# Altium project knoobs.PrjPcb
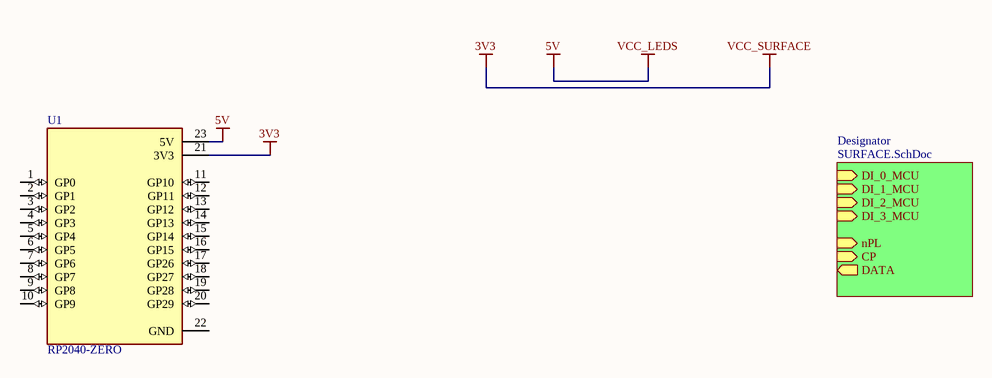
[diagram p0: KNOOBS_2040_ZERO.SchDoc]
5 sheets, 147 parts. Net scope: hierarchical (ports join the sheet entries above them; power ports are global).
Board file: KNOOBS_2040_ZERO.PcbDoc
Sheets:
  KNOOBS_2040_ZERO.SchDoc
    Designator = SURFACE.SchDoc
      BTN_FUNC = SR.SchDoc
      BANK_A = 16KNOBS.SchDoc
        K13 = KNOB.SchDoc
        K14 = KNOB.SchDoc
        K09 = KNOB.SchDoc
        K10 = KNOB.SchDoc
        K15 = KNOB.SchDoc
        K16 = KNOB.SchDoc
        K11 = KNOB.SchDoc
        K12 = KNOB.SchDoc
        BTN_TOP = SR.SchDoc
        SX_TOP = SR.SchDoc
        DX_TOP = SR.SchDoc
        K05 = KNOB.SchDoc
        K06 = KNOB.SchDoc
        K01 = KNOB.SchDoc
        K02 = KNOB.SchDoc
        K07 = KNOB.SchDoc
        K08 = KNOB.SchDoc
        K03 = KNOB.SchDoc
        K04 = KNOB.SchDoc
        BTN_BOT = SR.SchDoc
        SX_BOT = SR.SchDoc
        DX_BOT = SR.SchDoc

## Sheet KNOOBS_2040_ZERO.SchDoc
size A4; SheetNumber: 1; SheetTotal: 5

### Parts
U1  RP2040-ZERO  [MODULE_RP2040-ZERO]

### Sub-sheets
Designator = SURFACE.SchDoc: DI_0_MCU (in), DI_1_MCU (in), DI_2_MCU (in), DI_3_MCU (in), nPL (in), CP (in), DATA (out)

### Nets
3V3: U1.21(3V3)  [also labelled VCC_SURFACE]
5V: U1.23(5V)  [also labelled VCC_LEDS]

Not connected (* = marked no-connect by the designer): U1 1(GP0) 2(GP1) 3(GP2) 4(GP3) 5(GP4) 6(GP5) 7(GP6) 8(GP7) 9(GP8) 10(GP9) 11(GP10) 12(GP11) 13(GP12) 14(GP13) 15(GP14) 16(GP15) 17(GP26) 18(GP27) 19(GP28) 20(GP29) 22(GND)

### Library data of the parts
U1 = RP2040-ZERO: Low-Cost, High-Performance Pico-Like MCU Board Based On Raspberry Pi Microcontroller RP2040; MF: Waveshare Electronics; SnapEDA_Link: https://www.snapeda.com/parts/RP2040-ZERO/Waveshare+Electronics/view-part/?ref=snap; Package: Package; Value: *; MP: RP2040-ZERO; Check_prices: https://www.snapeda.com/parts/RP2040-ZERO/Waveshare+Electronics/view-part/?ref=eda

## Sheet SURFACE.SchDoc
size A4; SheetNumber: 2; SheetTotal: 5
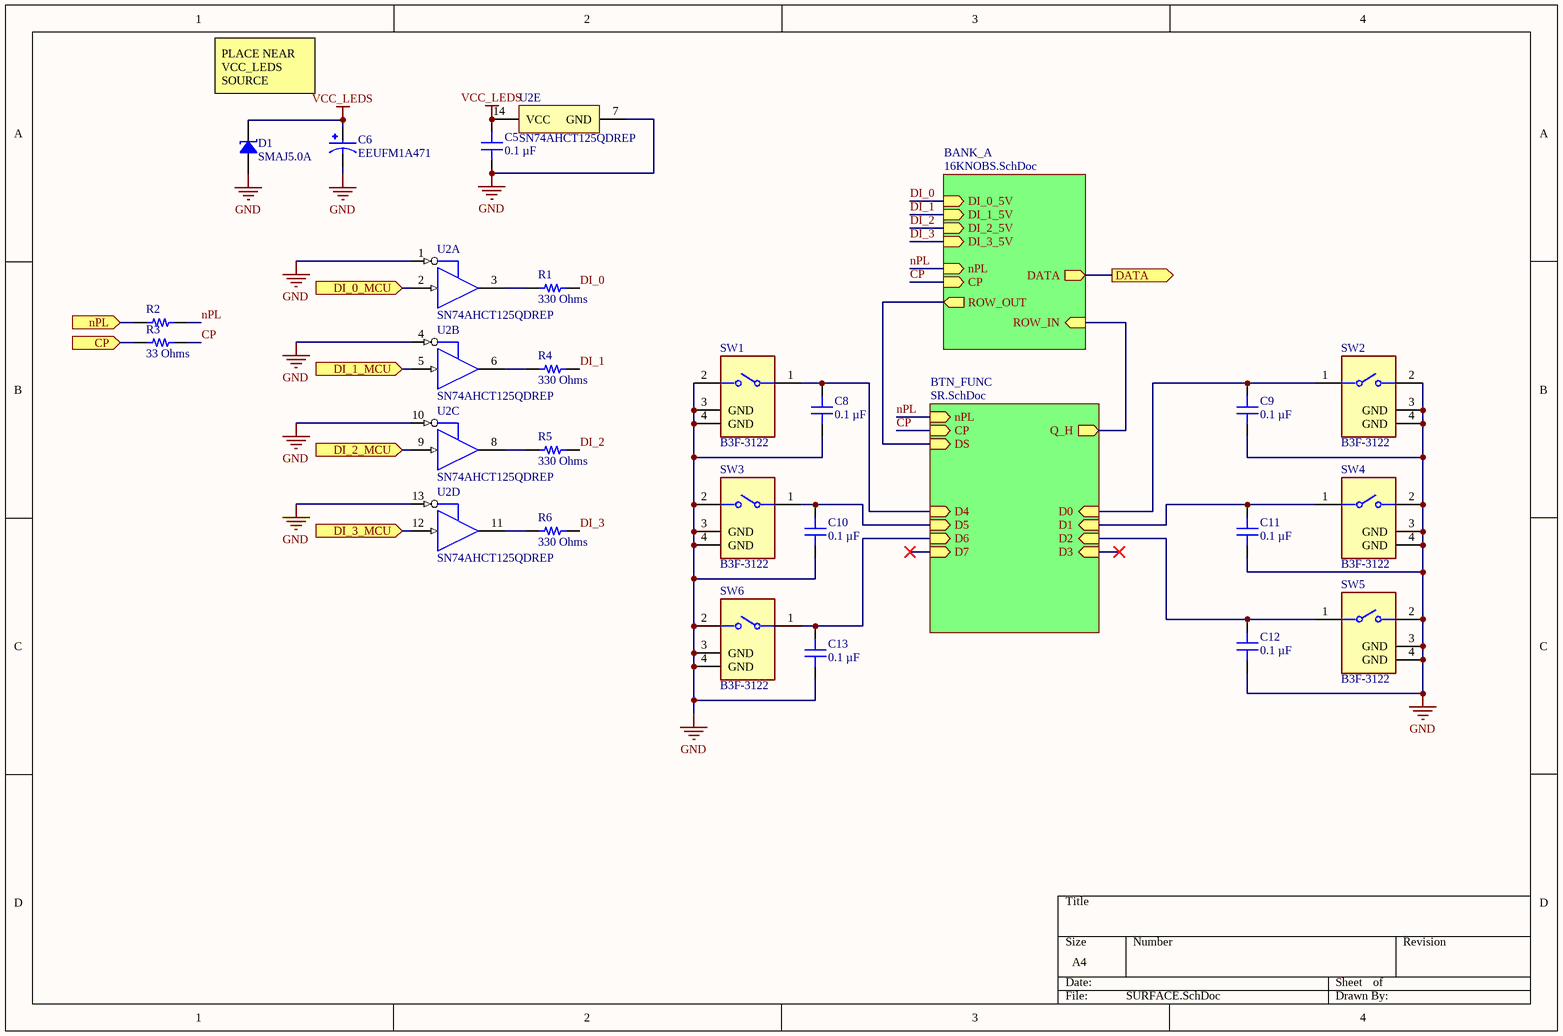
[diagram p1: SURFACE.SchDoc]

### Parts
C5  0.1 µF  [CAP 0603_1608]
C6  EEUFM1A471  [CAPPRD350W60D800H1150]
C8  0.1 µF  [CAP 0603_1608]
C9  0.1 µF  [CAP 0603_1608]
C10  0.1 µF  [CAP 0603_1608]
C11  0.1 µF  [CAP 0603_1608]
C12  0.1 µF  [CAP 0603_1608]
C13  0.1 µF  [CAP 0603_1608]
D1  SMAJ5.0A  [DO214AC SMA]
R1  330 Ohms  [YAGEO RES 0603_1608]
R2  33 Ohms  [YAGEO RES 0603_1608]  (value not drawn)
R3  33 Ohms  [YAGEO RES 0603_1608]
R4  330 Ohms  [YAGEO RES 0603_1608]
R5  330 Ohms  [YAGEO RES 0603_1608]
R6  330 Ohms  [YAGEO RES 0603_1608]
SW1  B3F-3122  [FP-B3F-3122-MFG]
SW2  B3F-3122  [FP-B3F-3122-MFG]
SW3  B3F-3122  [FP-B3F-3122-MFG]
SW4  B3F-3122  [FP-B3F-3122-MFG]
SW5  B3F-3122  [FP-B3F-3122-MFG]
SW6  B3F-3122  [FP-B3F-3122-MFG]
U2  SN74AHCT125QDREP  [D0014A_L]  (parts A,B,C,D,E of 5)

### Sub-sheets
BANK_A = 16KNOBS.SchDoc: DI_0_5V (in), DI_1_5V (in), nPL (in), CP (in), DI_2_5V (in), DI_3_5V (in), DATA (out), ROW_IN (in), ROW_OUT (out)
BTN_FUNC = SR.SchDoc: nPL (in), CP (in), DS (in), Q_H (out), D4 (in), D5 (in), D6 (in), D7 (in), D0 (in), D1 (in), D2 (in), D3 (in)

### Ports
CP (in), DATA (out), DI_0_MCU (in), DI_1_MCU (in), DI_2_MCU (in), DI_3_MCU (in), nPL (in)

### Nets
GND: C5.1 C6.N C8.1 C9.1 C10.1 C11.1 C12.1 C13.1 D1.1 SW1.2 SW1.3(GND) SW1.4(GND) SW2.2 SW2.3(GND) SW2.4(GND) SW3.2 SW3.3(GND) SW3.4(GND) SW4.2 SW4.3(GND) SW4.4(GND) SW5.2 SW5.3(GND) SW5.4(GND) SW6.2 SW6.3(GND) SW6.4(GND) U2.1(1~{OE}) U2.4(2~{OE}) U2.7(GND) U2.10(3~{OE}) U2.13(4~{OE})
VCC_LEDS: C5.2 C6.P D1.2 U2.14(VCC)  [project net 5V]
CP: R3.2 ; sheet BTN_FUNC/CP, sheet BANK_A/CP
DI_0: R1.2 ; sheet BANK_A/DI_0_5V
DI_1: R4.2 ; sheet BANK_A/DI_1_5V
DI_2: R5.2 ; sheet BANK_A/DI_2_5V
DI_3: R6.2 ; sheet BANK_A/DI_3_5V
nPL: R2.2 ; sheet BTN_FUNC/nPL, sheet BANK_A/nPL
NetC8_2: C8.2 SW1.1 ; sheet BTN_FUNC/D4
NetC9_2: C9.2 SW2.1 ; sheet BTN_FUNC/D0
NetC10_2: C10.2 SW3.1 ; sheet BTN_FUNC/D5
NetC11_2: C11.2 SW4.1 ; sheet BTN_FUNC/D1
NetC12_2: C12.2 SW5.1 ; sheet BTN_FUNC/D2
NetC13_2: C13.2 SW6.1 ; sheet BTN_FUNC/D6
NetR1_1: R1.1 U2.3(1Y)
NetR2_1: R2.1 ; port nPL
NetR3_1: R3.1 ; port CP
NetR4_1: R4.1 U2.6(2Y)
NetR5_1: R5.1 U2.8(3Y)
NetR6_1: R6.1 U2.11(4Y)
NetSR_BTN_FUNC_9: sheet BTN_FUNC/Q_H, sheet BANK_A/ROW_IN
NetSR_BTN_FUNC_10: sheet BTN_FUNC/DS, sheet BANK_A/ROW_OUT
NetSR_DX_TOP_9: port DATA, sheet BANK_A/DATA
NetU2_2: U2.2(1A) ; port DI_0_MCU
NetU2_5: U2.5(2A) ; port DI_1_MCU
NetU2_9: U2.9(3A) ; port DI_2_MCU
NetU2_12: U2.12(4A) ; port DI_3_MCU

### Notes on the sheet
- PLACE NEAR
  VCC_LEDS SOURCE

### Library data of the parts
C5 C8-C13 = CC0603KPX7R7BB104: CAP CER 0.1UF 16V X7R 0603; manufacturer: Yageo; Tolerance: ±10%; Part Number: CC0603KPX7R7BB104; Value: 0.1 µF; Applications: General Purpose; Capacitance: 0.1 µF; componentlink1description: Datasheet; componentlink1url: https://www.yageo.com/upload/media/product/productsearch/datasheet/mlcc/UPY-GPHC_X7R_6.3V-to-50V_18.pdf; componentlink2description: DigiKey Link; componentlink2url: https://www.digikey.com/en/products/detail/yageo/CC0603KPX7R7BB104/2103073; Device Package: 0603 (1608 Metric); lastupdated: 2/9/2024 8:10:09 PM; Lifecycle Status: Active; Minimum Order: 1; Mounting Type: Surface Mount, MLCC; Operating Temperature: -55°C ~ 125°C; Package / Case: 0603 (1608 Metric); packaging: TapeAndReel; partid: 16718; Part Status: Active; price: 0.01; series: CC; Size / Dimension: 0.063" L x 0.031" W (1.60mm x 0.80mm); Supplier 1: DigiKey; Supplier Part Number 1: 311-1335-1-ND; Temperature Coefficient: X7R; Thickness (Max): 0.035" (0.90mm); Voltage - Rated: 16V
C6 = EEUFM1A471: Cap Aluminum Lytic 470uF 10V 20% (8 X 11.5mm) Radial 3.5mm 950mA 3000h 105C Bulk; MP: EEU-FM1A471; MF: Panasonic; Purchase-URL: https://pricing.snapeda.com/search/part/EEU-FM1A471/?ref=eda; SnapEDA_Link: https://www.snapeda.com/parts/EEU-FM1A471/Panasonic/view-part/2301689/?ref=snap; Check_prices: https://www.snapeda.com/parts/EEU-FM1A471/Panasonic/view-part/2301689/?ref=eda; Availability: In Stock; Package: RADIAL-2 Panasonic; Value: *; Price: None
D1 = SMAJ5.0A: TVS DIODE 5VWM 9.2VC DO214AC; Manufacturer: Littelfuse Inc.; Current - Peak Pulse (10/1000µs): 43.5A; Power Line Protection: No; Power - Peak Pulse: 400W; Type: Zener; Unidirectional Channels: 1; Voltage - Breakdown (Min): 6.4V; Voltage - Clamping (Max) @ Ipp: 9.2V; Voltage - Reverse Standoff (Typ): 5V; Part Number: SMAJ5.0A; Applications: General Purpose; ComponentLink1Description: Datasheet; ComponentLink1URL: https://www.littelfuse.com/~/media/electronics/datasheets/tvs_diodes/littelfuse_tvs_diode_smaj_datasheet.pdf.pdf; ComponentLink2Description: DigiKey Link; ComponentLink2URL: https://www.digikey.com/en/products/detail/littelfuse-inc/SMAJ5-0A/762250; LastUpdated: 6/3/2024 7:57:22 PM; Lifecycle Status: Active; Minimum Order: 1; Mounting Type: Surface Mount; Operating Temperature: -65°C ~ 150°C (TJ); Package / Case: DO-214AC, SMA; Packaging: TapeAndReel; PartId: 5719; Part Status: Active; Price: 0.09; Series: SMAJ; Supplier 1: DigiKey; Supplier Part Number 1: SMAJ5.0ALFCT-ND; Supplier Device Package: DO-214AC (SMA)
R1 R4-R6 = RC0603JR-07330RP: RES 330 OHM 5% 1/10W 0603; Manufacturer: Yageo; Power (Watts): 0.1W, 1/10W; Ratings: 7C1 RoHS w/out Exemption (100% Pb-Free); Temperature Coefficient: ±100ppm/°C; Part Number: RC0603JR-07330RP; Value: 330 Ohms; ComponentLink1Description: Datasheet; ComponentLink1URL: http://www.yageo.com/NewPortal/yageodocoutput?fileName=/pdf/R-Chip/PYu-RC_51_RoHS_P_0.pdf; ComponentLink2Description: DigiKey Link; ComponentLink2URL: https://www.digikey.com/en/products/detail/yageo/RC0603JR-07330RP/4935329; Composition: Thick Film; Device Package: 0603 (1608 Metric); Features: Moisture Resistant; Height - Seated (Max): 0.022" (0.55mm); LastUpdated: 7/25/2024 9:19:30 AM; Lifecycle Status: Active; Minimum Order: 1; Number of Terminations: 2; Operating Temperature: -55°C ~ 155°C; Package / Case: 0603 (1608 Metric); Packaging: TapeAndReel; PartId: 9775; Part Status: Active; Price: 0.01; Resistance: 330 Ohms; Series: RC_P; Size / Dimension: 0.063" L x 0.031" W (1.60mm x 0.80mm); Supplier 1: DigiKey; Supplier Part Number 1: YAG1314CT-ND; Supplier Device Package: 0603; Tolerance: ±5%
R2 R3 = RC0603JR-0733RL: RES 33 OHM 5% 1/10W 0603; Manufacturer: Yageo; Power (Watts): 0.1W, 1/10W; Temperature Coefficient: ±100ppm/°C; Part Number: RC0603JR-0733RL; Value: 33 Ohms; ComponentLink1Description: Datasheet; ComponentLink1URL: https://www.yageo.com/upload/media/product/productsearch/datasheet/rchip/PYu-RC_Group_51_RoHS_L_10.pdf; ComponentLink2Description: DigiKey Link; ComponentLink2URL: https://www.digikey.com/en/products/detail/yageo/RC0603JR-0733RL/726771; Composition: Thick Film; Device Package: 0603 (1608 Metric); Features: Moisture Resistant; Height - Seated (Max): 0.022" (0.55mm); LastUpdated: 7/25/2024 9:19:24 AM; Lifecycle Status: Active; Minimum Order: 1; Number of Terminations: 2; Operating Temperature: -55°C ~ 155°C; Package / Case: 0603 (1608 Metric); Packaging: CutTape; PartId: 17082; Part Status: Active; Price: 0.01; Resistance: 33 Ohms; Series: RC_L; Size / Dimension: 0.063" L x 0.031" W (1.60mm x 0.80mm); Supplier 1: DigiKey; Supplier Part Number 1: 311-33GRCT-ND; Supplier Device Package: 0603; Tolerance: ±5%
SW1-SW6 = CMP-08834-000053-1: SWITCH TACTILE SPST-NO 0.05A 24V; Max Current Rating: 50mA; Actuator Type: Standard; Ratings: IP00; Number of Poles: 1; Mechanical Life: 300000Cycles; Illumination Type: Non-Illuminated; Switch Function: Off-Mom; Actuator Color: Grey; Contact Resistance: 100mR; Throw Configuration: SPST; Actuator Length: 1.6mm; Switch Travel: 0.25mm; Operating Force: 1.47N; Weight: 0.25g; Voltage Rating (DC): 24V; Contact Plating: Gold; RoHS Compliant: Yes; Contact Material: Gold; Radiation Hardening: No; Packaging: Bulk; Height: 7.4mm; Min Operating Temperature: -25°C; Electrical Life: 300000Cycles; Depth: 7.85mm; Max Voltage Rating (DC): 24V; Mount: Through Hole; Width: 6.25mm; Current Rating: 50mA; Lead Free: Lead Free; Max Operating Temperature: 70°C; Series: B3F; Contact Current Rating: 50mA; Package Quantity: 1000; Termination: PC Pins; Orientation: Right Angle; Length: 7.3mm
U2 = CMP-0440-00320-3: Enhanced Product Quadruple Bus Buffer Gates With 3-State Outputs, D0014A, LARGE T&R; Manufacturer: Texas Instruments; Generic Part Number: SN74AHCT125-EP; Output Type: CMOS; VCC(Min)(V): 4.5; Input Type: TTL; Rating: HiRel Enhanced Product; ICC @ Nom Voltage(Max)(mA): 0.02; tpd @ Nom Voltage(Max)(ns): 8.5; VCC(Max)(V): 5.5; Voltage(Nom)(V): 5; F @ Nom Voltage(Max)(Mhz): 110; Operating Temperature Range(C): -40 to 125; PackageReference: D0014A; DatasheetVersion: SCLS549; Code_JEDEC: MS-012; PackageVersion: http://www.ti.com/lit/ml/mpds177g/mpds177g.pdf

## Sheet SR.SchDoc
size A4; SheetNumber: 5; SheetTotal: 5
Used 7 times, as channels Designator/BTN_FUNC, Designator/BANK_A/BTN_TOP, Designator/BANK_A/SX_TOP, Designator/BANK_A/DX_TOP, Designator/BANK_A/BTN_BOT, Designator/BANK_A/SX_BOT, Designator/BANK_A/DX_BOT. Parts and nets are listed once, with the designators drawn on the sheet.
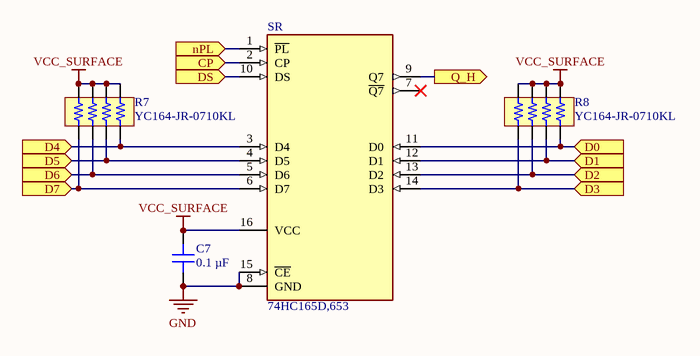
[diagram p2: SR.SchDoc]

### Parts
C7  0.1 µF  [CAP 0603_1608]
R7  YC164-JR-0710KL  [RESNET 1206-8 CONVEX]
R8  YC164-JR-0710KL  [RESNET 1206-8 CONVEX]
SR  74HC165D,653  [FP-SOT109-1-MFG]

### Ports
CP (in), D0 (in), D1 (in), D2 (in), D3 (in), D4 (in), D5 (in), D6 (in), D7 (in), DS (in), nPL (in), Q_H (out)

### Nets
GND: C7.1 SR.8(GND) SR.15(~{CE})
VCC_SURFACE: C7.2 R7.5 R7.6 R7.7 R7.8 R8.5 R8.6 R8.7 R8.8 SR.16(VCC)
CP: SR.2(CP) ; port CP
D0: R8.4 SR.11(D0) ; port D0
D1: R8.3 SR.12(D1) ; port D1
D2: R8.2 SR.13(D2) ; port D2
D3: R8.1 SR.14(D3) ; port D3
D4: R7.4 SR.3(D4) ; port D4
D5: R7.3 SR.4(D5) ; port D5
D6: R7.2 SR.5(D6) ; port D6
D7: R7.1 SR.6(D7) ; port D7
DS: SR.10(DS) ; port DS
nPL: SR.1(~{PL}) ; port nPL
Q_H: SR.9(Q7) ; port Q_H

Not connected (* = marked no-connect by the designer): SR 7(~{Q7})*

### Channels
Designator/BTN_FUNC: designators end in _BTN_FUNC; ports CP=CP D0=NetC9_2 D1=NetC11_2 D2=NetC12_2 D3=NetR8_BTN_FUNC_1 D4=NetC8_2 D5=NetC10_2 D6=NetC13_2 D7=NetR7_BTN_FUNC_1 DS=NetSR_BTN_FUNC_10 nPL=nPL Q_H=NetSR_BTN_FUNC_9
Designator/BANK_A/BTN_TOP: designators end in _BTN_TOP; ports CP=CP D0=NetC2_K09_2 D1=NetC2_K10_2 D2=NetC2_K11_2 D3=NetC2_K12_2 D4=NetC2_K16_2 D5=NetC2_K15_2 D6=NetC2_K14_2 D7=NetC2_K13_2 DS=NetSR_BTN_TOP_10 nPL=nPL Q_H=NetSR_BTN_TOP_9
Designator/BANK_A/SX_TOP: designators end in _SX_TOP; ports CP=CP D0=NetC3_K09_2 D1=NetC1_K09_2 D2=NetC3_K10_2 D3=NetC1_K10_2 D4=NetC3_K14_2 D5=NetC1_K14_2 D6=NetC3_K13_2 D7=NetC1_K13_2 DS=NetSR_BTN_FUNC_9 nPL=nPL Q_H=NetSR_BTN_TOP_10
Designator/BANK_A/DX_TOP: designators end in _DX_TOP; ports CP=CP D0=NetC3_K11_2 D1=NetC1_K11_2 D2=NetC3_K12_2 D3=NetC1_K12_2 D4=NetC3_K16_2 D5=NetC1_K16_2 D6=NetC3_K15_2 D7=NetC1_K15_2 DS=NetSR_BTN_TOP_9 nPL=nPL Q_H=NetSR_DX_TOP_9
Designator/BANK_A/BTN_BOT: designators end in _BTN_BOT; ports CP=CP D0=NetC2_K08_2 D1=NetC2_K07_2 D2=NetC2_K06_2 D3=NetC2_K05_2 D4=NetC2_K01_2 D5=NetC2_K02_2 D6=NetC2_K03_2 D7=NetC2_K04_2 DS=NetSR_BTN_BOT_10 nPL=nPL Q_H=NetSR_BTN_BOT_9
Designator/BANK_A/SX_BOT: designators end in _SX_BOT; ports CP=CP D0=NetC3_K06_2 D1=NetC1_K06_2 D2=NetC3_K05_2 D3=NetC1_K05_2 D4=NetC3_K01_2 D5=NetC1_K01_2 D6=NetC3_K02_2 D7=NetC1_K02_2 DS=NetSR_BTN_BOT_9 nPL=nPL Q_H=NetSR_BTN_FUNC_10
Designator/BANK_A/DX_BOT: designators end in _DX_BOT; ports CP=CP D0=NetC3_K08_2 D1=NetC1_K08_2 D2=NetC3_K07_2 D3=NetC1_K07_2 D4=NetC3_K03_2 D5=NetC1_K03_2 D6=NetC3_K04_2 D7=NetC1_K04_2 DS=GND nPL=nPL Q_H=NetSR_BTN_BOT_10

### Library data of the parts
C7 = CC0603KPX7R7BB104: as C5 on sheet SURFACE; Part Number: CC0603KPX7R7BB104; Value: 0.1 µF; Applications: General Purpose; Capacitance: 0.1 µF; componentlink1description: Datasheet; componentlink1url: https://www.yageo.com/upload/media/product/productsearch/datasheet/mlcc/UPY-GPHC_X7R_6.3V-to-50V_18.pdf; componentlink2description: DigiKey Link; componentlink2url: https://www.digikey.com/en/products/detail/yageo/CC0603KPX7R7BB104/2103073; Device Package: 0603 (1608 Metric); lastupdated: 2/9/2024 8:10:09 PM; Lifecycle Status: Active; Minimum Order: 1; Mounting Type: Surface Mount, MLCC; Operating Temperature: -55°C ~ 125°C; Package / Case: 0603 (1608 Metric); packaging: TapeAndReel; partid: 16718; Part Status: Active; price: 0.01; series: CC; Size / Dimension: 0.063" L x 0.031" W (1.60mm x 0.80mm); Supplier 1: DigiKey; Supplier Part Number 1: 311-1335-1-ND; Temperature Coefficient: X7R; Thickness (Max): 0.035" (0.90mm); Voltage - Rated: 16V
R7 R8 = YC164-JR-0710KL: RES ARRAY 4 RES 10K OHM 1206; Manufacturer: Yageo; Circuit Type: Isolated; Number of Resistors: 4; Power Per Element: 62.5mW; Temperature Coefficient: ±200ppm/°C; Tolerance: ±5%; Part Number: YC164-JR-0710KL; Applications: DDRAM, SDRAM; ComponentLink1Description: Datasheet; ComponentLink1URL: https://www.yageo.com/upload/media/product/productsearch/datasheet/rchip/PYu-YC_TC_group_51_RoHS_L_9.pdf; ComponentLink2Description: DigiKey Link; ComponentLink2URL: http://digikey.com/product-detail/en/yageo/YC164-JR-0710KL/YC164J-10KCT-ND/1005702; Height - Seated (Max): 0.028" (0.70mm); LastUpdated: 9/2/2020 1:23:24 AM; Lifecycle Status: Active; Minimum Order: 1; Mounting Type: Surface Mount; Number of Pins: 8; Operating Temperature: -55°C ~ 155°C; Package / Case: 1206 (3216 Metric), Convex, Long Side Terminals; Packaging: TapeAndReel; PartId: 146; Part Status: Active; Price: 0.01; Resistance (Ohms): 10k; Series: YC164; Size / Dimension: 0.126" L x 0.063" W (3.20mm x 1.60mm); Supplier 1: DigiKey; Supplier Part Number 1: YC164J-10KCT-ND
SR = CMP-14351-000001-1: IC SHIFT REGST 8BIT PI-SO 16SOIC; Manufacturer: Nexperia; Standoff Height: 0.1mm; Number Of Inputs: 8; Logic Function Desc: Shift Register; Nominal Supply Current: 8uA; Number Of Circuits: 1; Propagation Delay: 15ns; Min Supply Voltage: 2V; Frequency: 61MHz; Max Supply Voltage: 6V; Height: 1.75mm; Digikey Description: IC SHIFT REGST 8BIT PI-SO 16SOIC; ComponentLink2URL: https://assets.nexperia.com/documents/data-sheet/74HC_HCT165.pdf; Ipc Land Pattern Name: SOP127P600X175-16; Temperature Range High: +125°C; Manufacturer Part Number: 74HC165D,653; Temperature: -40°C to +125°C; Device Class L2: Logic ICs; Device Class L1: Integrated Circuits (ICs); Lead Free: Yes; Number Of Outputs: 1; Ambient Temperature Range High: +125°C; ComponentLink2Description: Datasheet; Temperature Range Low: -40°C; Category: IC; RoHS: TRUE; Automotive: No; Device Class L3: Shift Registers; Octopart: https://octopart.com/74hc165d%2C653-nexperia-78737091; Footprint Url: https://assets.nexperia.com/documents/outline-drawing/SOT109-1.pdf; Ambient Temperature Range Low: -40°C; Package: SOT109-1

## Sheet 16KNOBS.SchDoc
size A4; SheetNumber: 3; SheetTotal: 5
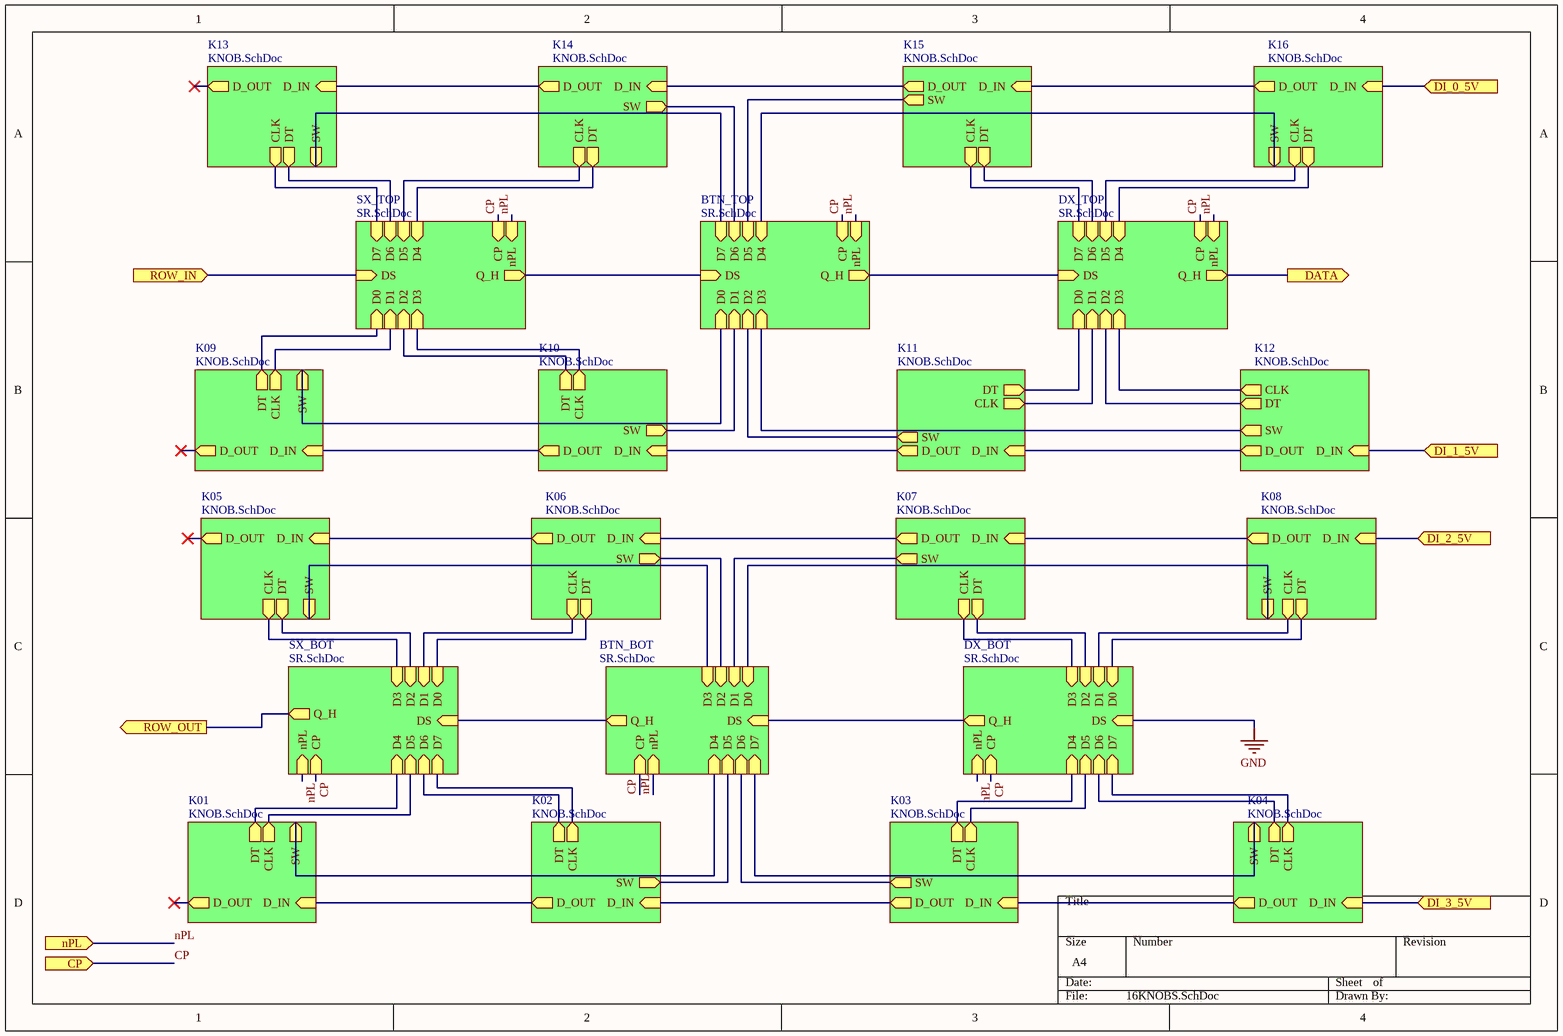
[diagram p3: 16KNOBS.SchDoc]

### Sub-sheets
BTN_BOT = SR.SchDoc: nPL (in), CP (in), DS (in), Q_H (out), D4 (in), D5 (in), D6 (in), D7 (in), D0 (in), D1 (in), D2 (in), D3 (in)
BTN_TOP = SR.SchDoc: nPL (in), CP (in), DS (in), Q_H (out), D4 (in), D5 (in), D6 (in), D7 (in), D0 (in), D1 (in), D2 (in), D3 (in)
DX_BOT = SR.SchDoc: nPL (in), CP (in), DS (in), Q_H (out), D4 (in), D5 (in), D6 (in), D7 (in), D0 (in), D1 (in), D2 (in), D3 (in)
DX_TOP = SR.SchDoc: nPL (in), CP (in), DS (in), Q_H (out), D4 (in), D5 (in), D6 (in), D7 (in), D0 (in), D1 (in), D2 (in), D3 (in)
K01 = KNOB.SchDoc: SW (out), DT (out), CLK (out), D_IN (in), D_OUT (out)
K02 = KNOB.SchDoc: SW (out), DT (out), CLK (out), D_IN (in), D_OUT (out)
K03 = KNOB.SchDoc: SW (out), DT (out), CLK (out), D_IN (in), D_OUT (out)
K04 = KNOB.SchDoc: SW (out), DT (out), CLK (out), D_IN (in), D_OUT (out)
K05 = KNOB.SchDoc: SW (out), DT (out), CLK (out), D_IN (in), D_OUT (out)
K06 = KNOB.SchDoc: SW (out), DT (out), CLK (out), D_IN (in), D_OUT (out)
K07 = KNOB.SchDoc: SW (out), DT (out), CLK (out), D_IN (in), D_OUT (out)
K08 = KNOB.SchDoc: SW (out), DT (out), CLK (out), D_IN (in), D_OUT (out)
K09 = KNOB.SchDoc: SW (out), DT (out), CLK (out), D_IN (in), D_OUT (out)
K10 = KNOB.SchDoc: SW (out), DT (out), CLK (out), D_IN (in), D_OUT (out)
K11 = KNOB.SchDoc: SW (out), DT (out), CLK (out), D_IN (in), D_OUT (out)
K12 = KNOB.SchDoc: SW (out), DT (out), CLK (out), D_IN (in), D_OUT (out)
K13 = KNOB.SchDoc: SW (out), DT (out), CLK (out), D_IN (in), D_OUT (out)
K14 = KNOB.SchDoc: SW (out), DT (out), CLK (out), D_IN (in), D_OUT (out)
K15 = KNOB.SchDoc: SW (out), DT (out), CLK (out), D_IN (in), D_OUT (out)
K16 = KNOB.SchDoc: SW (out), DT (out), CLK (out), D_IN (in), D_OUT (out)
SX_BOT = SR.SchDoc: nPL (in), CP (in), DS (in), Q_H (out), D4 (in), D5 (in), D6 (in), D7 (in), D0 (in), D1 (in), D2 (in), D3 (in)
SX_TOP = SR.SchDoc: nPL (in), CP (in), DS (in), Q_H (out), D4 (in), D5 (in), D6 (in), D7 (in), D0 (in), D1 (in), D2 (in), D3 (in)

### Ports
CP (in), DATA (out), DI_0_5V (in), DI_1_5V (in), DI_2_5V (in), DI_3_5V (in), nPL (in), ROW_IN (in), ROW_OUT (out)

### Nets
CP: port CP, sheet BTN_TOP/CP, sheet SX_TOP/CP, sheet DX_TOP/CP, sheet BTN_BOT/CP, sheet SX_BOT/CP, sheet DX_BOT/CP
DI_0: port DI_0_5V, sheet K16/D_IN
DI_1: port DI_1_5V, sheet K12/D_IN
DI_2: port DI_2_5V, sheet K08/D_IN
DI_3: port DI_3_5V, sheet K04/D_IN
nPL: port nPL, sheet BTN_TOP/nPL, sheet SX_TOP/nPL, sheet DX_TOP/nPL, sheet BTN_BOT/nPL, sheet SX_BOT/nPL, sheet DX_BOT/nPL
NetC1_K01_2: sheet K01/CLK, sheet SX_BOT/D5
NetC1_K02_2: sheet K02/CLK, sheet SX_BOT/D7
NetC1_K03_2: sheet K03/CLK, sheet DX_BOT/D5
NetC1_K04_2: sheet K04/CLK, sheet DX_BOT/D7
NetC1_K05_2: sheet K05/CLK, sheet SX_BOT/D3
NetC1_K06_2: sheet K06/CLK, sheet SX_BOT/D1
NetC1_K07_2: sheet K07/CLK, sheet DX_BOT/D3
NetC1_K08_2: sheet K08/CLK, sheet DX_BOT/D1
NetC1_K09_2: sheet K09/CLK, sheet SX_TOP/D1
NetC1_K10_2: sheet K10/CLK, sheet SX_TOP/D3
NetC1_K11_2: sheet K11/CLK, sheet DX_TOP/D1
NetC1_K12_2: sheet K12/CLK, sheet DX_TOP/D3
NetC1_K13_2: sheet K13/CLK, sheet SX_TOP/D7
NetC1_K14_2: sheet K14/CLK, sheet SX_TOP/D5
NetC1_K15_2: sheet K15/CLK, sheet DX_TOP/D7
NetC1_K16_2: sheet K16/CLK, sheet DX_TOP/D5
NetC2_K01_2: sheet K01/SW, sheet BTN_BOT/D4
NetC2_K02_2: sheet K02/SW, sheet BTN_BOT/D5
NetC2_K03_2: sheet K03/SW, sheet BTN_BOT/D6
NetC2_K04_2: sheet K04/SW, sheet BTN_BOT/D7
NetC2_K05_2: sheet K05/SW, sheet BTN_BOT/D3
NetC2_K06_2: sheet K06/SW, sheet BTN_BOT/D2
NetC2_K07_2: sheet K07/SW, sheet BTN_BOT/D1
NetC2_K08_2: sheet K08/SW, sheet BTN_BOT/D0
NetC2_K09_2: sheet K09/SW, sheet BTN_TOP/D0
NetC2_K10_2: sheet K10/SW, sheet BTN_TOP/D1
NetC2_K11_2: sheet K11/SW, sheet BTN_TOP/D2
NetC2_K12_2: sheet K12/SW, sheet BTN_TOP/D3
NetC2_K13_2: sheet K13/SW, sheet BTN_TOP/D7
NetC2_K14_2: sheet K14/SW, sheet BTN_TOP/D6
NetC2_K15_2: sheet K15/SW, sheet BTN_TOP/D5
NetC2_K16_2: sheet K16/SW, sheet BTN_TOP/D4
NetC3_K01_2: sheet K01/DT, sheet SX_BOT/D4
NetC3_K02_2: sheet K02/DT, sheet SX_BOT/D6
NetC3_K03_2: sheet K03/DT, sheet DX_BOT/D4
NetC3_K04_2: sheet K04/DT, sheet DX_BOT/D6
NetC3_K05_2: sheet K05/DT, sheet SX_BOT/D2
NetC3_K06_2: sheet K06/DT, sheet SX_BOT/D0
NetC3_K07_2: sheet K07/DT, sheet DX_BOT/D2
NetC3_K08_2: sheet K08/DT, sheet DX_BOT/D0
NetC3_K09_2: sheet K09/DT, sheet SX_TOP/D0
NetC3_K10_2: sheet K10/DT, sheet SX_TOP/D2
NetC3_K11_2: sheet K11/DT, sheet DX_TOP/D0
NetC3_K12_2: sheet K12/DT, sheet DX_TOP/D2
NetC3_K13_2: sheet K13/DT, sheet SX_TOP/D6
NetC3_K14_2: sheet K14/DT, sheet SX_TOP/D4
NetC3_K15_2: sheet K15/DT, sheet DX_TOP/D6
NetC3_K16_2: sheet K16/DT, sheet DX_TOP/D4
NetLED_K01_2: sheet K01/D_IN, sheet K02/D_OUT
NetLED_K02_2: sheet K02/D_IN, sheet K03/D_OUT
NetLED_K03_2: sheet K03/D_IN, sheet K04/D_OUT
NetLED_K05_2: sheet K05/D_IN, sheet K06/D_OUT
NetLED_K06_2: sheet K06/D_IN, sheet K07/D_OUT
NetLED_K07_2: sheet K07/D_IN, sheet K08/D_OUT
NetLED_K09_2: sheet K09/D_IN, sheet K10/D_OUT
NetLED_K10_2: sheet K10/D_IN, sheet K11/D_OUT
NetLED_K11_2: sheet K11/D_IN, sheet K12/D_OUT
NetLED_K13_2: sheet K13/D_IN, sheet K14/D_OUT
NetLED_K14_2: sheet K14/D_IN, sheet K15/D_OUT
NetLED_K15_2: sheet K15/D_IN, sheet K16/D_OUT
NetSR_BTN_BOT_9: sheet BTN_BOT/Q_H, sheet SX_BOT/DS
NetSR_BTN_BOT_10: sheet BTN_BOT/DS, sheet DX_BOT/Q_H
NetSR_BTN_FUNC_9: port ROW_IN, sheet SX_TOP/DS
NetSR_BTN_FUNC_10: port ROW_OUT, sheet SX_BOT/Q_H
NetSR_BTN_TOP_9: sheet BTN_TOP/Q_H, sheet DX_TOP/DS
NetSR_BTN_TOP_10: sheet BTN_TOP/DS, sheet SX_TOP/Q_H
NetSR_DX_TOP_9: port DATA, sheet DX_TOP/Q_H

## Sheet KNOB.SchDoc
size A4; SheetNumber: 4; SheetTotal: 5
Used 16 times, as channels Designator/BANK_A/K13, Designator/BANK_A/K14, Designator/BANK_A/K09, Designator/BANK_A/K10, Designator/BANK_A/K15, Designator/BANK_A/K16, Designator/BANK_A/K11, Designator/BANK_A/K12, Designator/BANK_A/K05, Designator/BANK_A/K06, Designator/BANK_A/K01, Designator/BANK_A/K02, Designator/BANK_A/K07, Designator/BANK_A/K08, Designator/BANK_A/K03, Designator/BANK_A/K04. Parts and nets are listed once, with the designators drawn on the sheet.
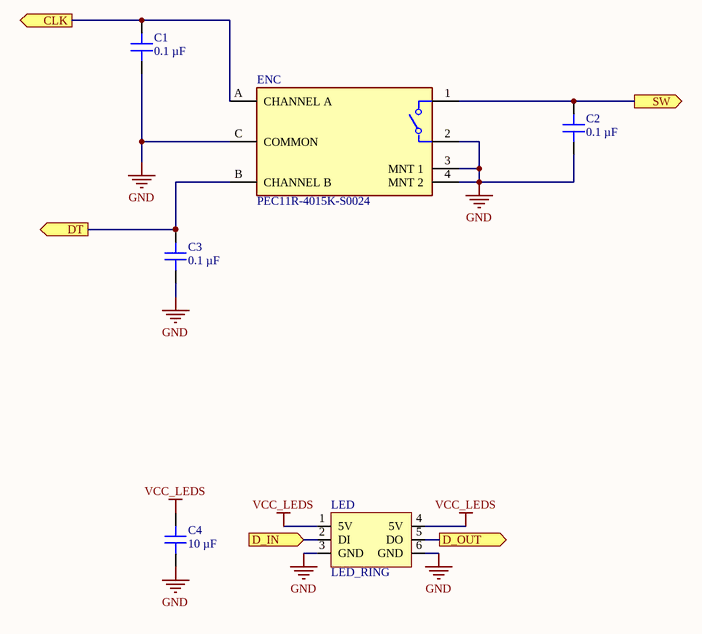
[diagram p4: KNOB.SchDoc]

### Parts
C1  0.1 µF  [CAP 0603_1608]
C2  0.1 µF  [CAP 0603_1608]
C3  0.1 µF  [CAP 0603_1608]
C4  10 µF  [MURATA GRM188 0603_1608]
ENC  PEC11R-4015K-S0024  [FP-PEC11R-4015K-S0024-MFG]
LED  LED_RING  [LED_RING]

### Ports
CLK (out), D_IN (in), D_OUT (out), DT (out), SW (out)

### Nets
GND: C1.1 C2.1 C3.1 C4.1 ENC.2 ENC.3(MNT_1) ENC.4(MNT_2) ENC.C(COMMON) LED.3(GND) LED.6(GND)
VCC_LEDS: C4.2 LED.1(5V) LED.4(5V)
CLK: C1.2 ENC.A(CHANNEL_A) ; port CLK
D_IN: LED.2(DI) ; port D_IN
D_OUT: LED.5(DO) ; port D_OUT
DT: C3.2 ENC.B(CHANNEL_B) ; port DT
SW: C2.2 ENC.1 ; port SW

### Channels
Designator/BANK_A/K13: designators end in _K13; ports CLK=NetC1_K13_2 D_IN=NetLED_K13_2 D_OUT=NetLED_K13_5 DT=NetC3_K13_2 SW=NetC2_K13_2
Designator/BANK_A/K14: designators end in _K14; ports CLK=NetC1_K14_2 D_IN=NetLED_K14_2 D_OUT=NetLED_K13_2 DT=NetC3_K14_2 SW=NetC2_K14_2
Designator/BANK_A/K09: designators end in _K09; ports CLK=NetC1_K09_2 D_IN=NetLED_K09_2 D_OUT=NetLED_K09_5 DT=NetC3_K09_2 SW=NetC2_K09_2
Designator/BANK_A/K10: designators end in _K10; ports CLK=NetC1_K10_2 D_IN=NetLED_K10_2 D_OUT=NetLED_K09_2 DT=NetC3_K10_2 SW=NetC2_K10_2
Designator/BANK_A/K15: designators end in _K15; ports CLK=NetC1_K15_2 D_IN=NetLED_K15_2 D_OUT=NetLED_K14_2 DT=NetC3_K15_2 SW=NetC2_K15_2
Designator/BANK_A/K16: designators end in _K16; ports CLK=NetC1_K16_2 D_IN=DI_0 D_OUT=NetLED_K15_2 DT=NetC3_K16_2 SW=NetC2_K16_2
Designator/BANK_A/K11: designators end in _K11; ports CLK=NetC1_K11_2 D_IN=NetLED_K11_2 D_OUT=NetLED_K10_2 DT=NetC3_K11_2 SW=NetC2_K11_2
Designator/BANK_A/K12: designators end in _K12; ports CLK=NetC1_K12_2 D_IN=DI_1 D_OUT=NetLED_K11_2 DT=NetC3_K12_2 SW=NetC2_K12_2
Designator/BANK_A/K05: designators end in _K05; ports CLK=NetC1_K05_2 D_IN=NetLED_K05_2 D_OUT=NetLED_K05_5 DT=NetC3_K05_2 SW=NetC2_K05_2
Designator/BANK_A/K06: designators end in _K06; ports CLK=NetC1_K06_2 D_IN=NetLED_K06_2 D_OUT=NetLED_K05_2 DT=NetC3_K06_2 SW=NetC2_K06_2
Designator/BANK_A/K01: designators end in _K01; ports CLK=NetC1_K01_2 D_IN=NetLED_K01_2 D_OUT=NetLED_K01_5 DT=NetC3_K01_2 SW=NetC2_K01_2
Designator/BANK_A/K02: designators end in _K02; ports CLK=NetC1_K02_2 D_IN=NetLED_K02_2 D_OUT=NetLED_K01_2 DT=NetC3_K02_2 SW=NetC2_K02_2
Designator/BANK_A/K07: designators end in _K07; ports CLK=NetC1_K07_2 D_IN=NetLED_K07_2 D_OUT=NetLED_K06_2 DT=NetC3_K07_2 SW=NetC2_K07_2
Designator/BANK_A/K08: designators end in _K08; ports CLK=NetC1_K08_2 D_IN=DI_2 D_OUT=NetLED_K07_2 DT=NetC3_K08_2 SW=NetC2_K08_2
Designator/BANK_A/K03: designators end in _K03; ports CLK=NetC1_K03_2 D_IN=NetLED_K03_2 D_OUT=NetLED_K02_2 DT=NetC3_K03_2 SW=NetC2_K03_2
Designator/BANK_A/K04: designators end in _K04; ports CLK=NetC1_K04_2 D_IN=DI_3 D_OUT=NetLED_K03_2 DT=NetC3_K04_2 SW=NetC2_K04_2

### Library data of the parts
C1-C3 = CC0603KPX7R7BB104: as C5 on sheet SURFACE; Part Number: CC0603KPX7R7BB104; Value: 0.1 µF; Applications: General Purpose; Capacitance: 0.1 µF; componentlink1description: Datasheet; componentlink1url: https://www.yageo.com/upload/media/product/productsearch/datasheet/mlcc/UPY-GPHC_X7R_6.3V-to-50V_18.pdf; componentlink2description: DigiKey Link; componentlink2url: https://www.digikey.com/en/products/detail/yageo/CC0603KPX7R7BB104/2103073; Device Package: 0603 (1608 Metric); lastupdated: 2/9/2024 8:10:09 PM; Lifecycle Status: Active; Minimum Order: 1; Mounting Type: Surface Mount, MLCC; Operating Temperature: -55°C ~ 125°C; Package / Case: 0603 (1608 Metric); packaging: TapeAndReel; partid: 16718; Part Status: Active; price: 0.01; series: CC; Size / Dimension: 0.063" L x 0.031" W (1.60mm x 0.80mm); Supplier 1: DigiKey; Supplier Part Number 1: 311-1335-1-ND; Temperature Coefficient: X7R; Thickness (Max): 0.035" (0.90mm); Voltage - Rated: 16V
C4 = GRM188Z71A106KA73D: CAP CER 10UF 10V X7R 0603; manufacturer: Murata Electronics; Tolerance: ±10%; Part Number: GRM188Z71A106KA73D; Value: 10 µF; Applications: General Purpose; Capacitance: 10 µF; componentlink1description: Datasheet; componentlink1url: https://search.murata.co.jp/Ceramy/image/img/A01X/G101/ENG/GRM188Z71A106KA73-01A.pdf; componentlink2description: DigiKey Link; componentlink2url: https://www.digikey.com/en/products/detail/murata-electronics/GRM188Z71A106KA73D/13401725; Device Package: 0603 (1608 Metric); lastupdated: 7/20/2024 12:23:19 AM; Lifecycle Status: Active; Minimum Order: 1; Mounting Type: Surface Mount, MLCC; Operating Temperature: -55°C ~ 125°C; Package / Case: 0603 (1608 Metric); packaging: TapeAndReel; partid: 44714; Part Status: Active; price: 0.06; series: GRM; Size / Dimension: 0.063" L x 0.031" W (1.60mm x 0.80mm); Supplier 1: DigiKey; Supplier Part Number 1: 490-GRM188Z71A106KA73DCT-ND; Temperature Coefficient: X7R; Thickness (Max): 0.039" (1.00mm); Voltage - Rated: 10V
ENC = CMP-07421-000013-1: ROTARY ENCODER MECHANICAL 24PPR; Output Type: Quadrature; Number of Channels: 2; Detent: No; Built in Switch: Yes; Pulses per Revolution: 24; Height: 13.4mm; Series: PEC11R; Package Quantity: 75; Encoder Type: Mechanical; Max Operating Temperature: 70°C; Packaging: Bulk; Mount: Through Hole; RoHS Compliant: Yes; Width: 12.5mm; Length: 21.5mm; Orientation: Vertical; Termination: PC Pin; Min Operating Temperature: -30°C

## Nets that join several sheets
3V3: KNOOBS_2040_ZERO (U1.21), Designator/BTN_FUNC (10 pins), Designator/BANK_A/BTN_TOP (10 pins), Designator/BANK_A/SX_TOP (10 pins), Designator/BANK_A/DX_TOP (10 pins), Designator/BANK_A/BTN_BOT (10 pins), Designator/BANK_A/SX_BOT (10 pins), Designator/BANK_A/DX_BOT (10 pins)
5V: KNOOBS_2040_ZERO (U1.23), SURFACE (C5.2 C6.P D1.2 U2.14), Designator/BANK_A/K13 (C4_K13.2 LED_K13.1 LED_K13.4), Designator/BANK_A/K14 (C4_K14.2 LED_K14.1 LED_K14.4), Designator/BANK_A/K09 (C4_K09.2 LED_K09.1 LED_K09.4), Designator/BANK_A/K10 (C4_K10.2 LED_K10.1 LED_K10.4), Designator/BANK_A/K15 (C4_K15.2 LED_K15.1 LED_K15.4), Designator/BANK_A/K16 (C4_K16.2 LED_K16.1 LED_K16.4), Designator/BANK_A/K11 (C4_K11.2 LED_K11.1 LED_K11.4), Designator/BANK_A/K12 (C4_K12.2 LED_K12.1 LED_K12.4), Designator/BANK_A/K05 (C4_K05.2 LED_K05.1 LED_K05.4), Designator/BANK_A/K06 (C4_K06.2 LED_K06.1 LED_K06.4), Designator/BANK_A/K01 (C4_K01.2 LED_K01.1 LED_K01.4), Designator/BANK_A/K02 (C4_K02.2 LED_K02.1 LED_K02.4), Designator/BANK_A/K07 (C4_K07.2 LED_K07.1 LED_K07.4), Designator/BANK_A/K08 (C4_K08.2 LED_K08.1 LED_K08.4), Designator/BANK_A/K03 (C4_K03.2 LED_K03.1 LED_K03.4), Designator/BANK_A/K04 (C4_K04.2 LED_K04.1 LED_K04.4)
GND: SURFACE (32 pins), Designator/BTN_FUNC (C7_BTN_FUNC.1 SR_BTN_FUNC.8 SR_BTN_FUNC.15), Designator/BANK_A/K13 (10 pins), Designator/BANK_A/K14 (10 pins), Designator/BANK_A/K09 (10 pins), Designator/BANK_A/K10 (10 pins), Designator/BANK_A/K15 (10 pins), Designator/BANK_A/K16 (10 pins), Designator/BANK_A/K11 (10 pins), Designator/BANK_A/K12 (10 pins), Designator/BANK_A/BTN_TOP (C7_BTN_TOP.1 SR_BTN_TOP.8 SR_BTN_TOP.15), Designator/BANK_A/SX_TOP (C7_SX_TOP.1 SR_SX_TOP.8 SR_SX_TOP.15), Designator/BANK_A/DX_TOP (C7_DX_TOP.1 SR_DX_TOP.8 SR_DX_TOP.15), Designator/BANK_A/K05 (10 pins), Designator/BANK_A/K06 (10 pins), Designator/BANK_A/K01 (10 pins), Designator/BANK_A/K02 (10 pins), Designator/BANK_A/K07 (10 pins), Designator/BANK_A/K08 (10 pins), Designator/BANK_A/K03 (10 pins), Designator/BANK_A/K04 (10 pins), Designator/BANK_A/BTN_BOT (C7_BTN_BOT.1 SR_BTN_BOT.8 SR_BTN_BOT.15), Designator/BANK_A/SX_BOT (C7_SX_BOT.1 SR_SX_BOT.8 SR_SX_BOT.15), Designator/BANK_A/DX_BOT (C7_DX_BOT.1 SR_DX_BOT.8 SR_DX_BOT.10 SR_DX_BOT.15)
CP: SURFACE (R3.2), Designator/BTN_FUNC (SR_BTN_FUNC.2), Designator/BANK_A/BTN_TOP (SR_BTN_TOP.2), Designator/BANK_A/SX_TOP (SR_SX_TOP.2), Designator/BANK_A/DX_TOP (SR_DX_TOP.2), Designator/BANK_A/BTN_BOT (SR_BTN_BOT.2), Designator/BANK_A/SX_BOT (SR_SX_BOT.2), Designator/BANK_A/DX_BOT (SR_DX_BOT.2)
DI_0: SURFACE (R1.2), Designator/BANK_A/K16 (LED_K16.2)
DI_1: SURFACE (R4.2), Designator/BANK_A/K12 (LED_K12.2)
DI_2: SURFACE (R5.2), Designator/BANK_A/K08 (LED_K08.2)
DI_3: SURFACE (R6.2), Designator/BANK_A/K04 (LED_K04.2)
NetC1_K01_2: Designator/BANK_A/K01 (C1_K01.2 ENC_K01.A), Designator/BANK_A/SX_BOT (R7_SX_BOT.3 SR_SX_BOT.4)
NetC1_K02_2: Designator/BANK_A/K02 (C1_K02.2 ENC_K02.A), Designator/BANK_A/SX_BOT (R7_SX_BOT.1 SR_SX_BOT.6)
NetC1_K03_2: Designator/BANK_A/K03 (C1_K03.2 ENC_K03.A), Designator/BANK_A/DX_BOT (R7_DX_BOT.3 SR_DX_BOT.4)
NetC1_K04_2: Designator/BANK_A/K04 (C1_K04.2 ENC_K04.A), Designator/BANK_A/DX_BOT (R7_DX_BOT.1 SR_DX_BOT.6)
NetC1_K05_2: Designator/BANK_A/K05 (C1_K05.2 ENC_K05.A), Designator/BANK_A/SX_BOT (R8_SX_BOT.1 SR_SX_BOT.14)
NetC1_K06_2: Designator/BANK_A/K06 (C1_K06.2 ENC_K06.A), Designator/BANK_A/SX_BOT (R8_SX_BOT.3 SR_SX_BOT.12)
NetC1_K07_2: Designator/BANK_A/K07 (C1_K07.2 ENC_K07.A), Designator/BANK_A/DX_BOT (R8_DX_BOT.1 SR_DX_BOT.14)
NetC1_K08_2: Designator/BANK_A/K08 (C1_K08.2 ENC_K08.A), Designator/BANK_A/DX_BOT (R8_DX_BOT.3 SR_DX_BOT.12)
NetC1_K09_2: Designator/BANK_A/K09 (C1_K09.2 ENC_K09.A), Designator/BANK_A/SX_TOP (R8_SX_TOP.3 SR_SX_TOP.12)
NetC1_K10_2: Designator/BANK_A/K10 (C1_K10.2 ENC_K10.A), Designator/BANK_A/SX_TOP (R8_SX_TOP.1 SR_SX_TOP.14)
NetC1_K11_2: Designator/BANK_A/K11 (C1_K11.2 ENC_K11.A), Designator/BANK_A/DX_TOP (R8_DX_TOP.3 SR_DX_TOP.12)
NetC1_K12_2: Designator/BANK_A/K12 (C1_K12.2 ENC_K12.A), Designator/BANK_A/DX_TOP (R8_DX_TOP.1 SR_DX_TOP.14)
NetC1_K13_2: Designator/BANK_A/K13 (C1_K13.2 ENC_K13.A), Designator/BANK_A/SX_TOP (R7_SX_TOP.1 SR_SX_TOP.6)
NetC1_K14_2: Designator/BANK_A/K14 (C1_K14.2 ENC_K14.A), Designator/BANK_A/SX_TOP (R7_SX_TOP.3 SR_SX_TOP.4)
NetC1_K15_2: Designator/BANK_A/K15 (C1_K15.2 ENC_K15.A), Designator/BANK_A/DX_TOP (R7_DX_TOP.1 SR_DX_TOP.6)
NetC1_K16_2: Designator/BANK_A/K16 (C1_K16.2 ENC_K16.A), Designator/BANK_A/DX_TOP (R7_DX_TOP.3 SR_DX_TOP.4)
NetC2_K01_2: Designator/BANK_A/K01 (C2_K01.2 ENC_K01.1), Designator/BANK_A/BTN_BOT (R7_BTN_BOT.4 SR_BTN_BOT.3)
NetC2_K02_2: Designator/BANK_A/K02 (C2_K02.2 ENC_K02.1), Designator/BANK_A/BTN_BOT (R7_BTN_BOT.3 SR_BTN_BOT.4)
NetC2_K03_2: Designator/BANK_A/K03 (C2_K03.2 ENC_K03.1), Designator/BANK_A/BTN_BOT (R7_BTN_BOT.2 SR_BTN_BOT.5)
NetC2_K04_2: Designator/BANK_A/K04 (C2_K04.2 ENC_K04.1), Designator/BANK_A/BTN_BOT (R7_BTN_BOT.1 SR_BTN_BOT.6)
NetC2_K05_2: Designator/BANK_A/K05 (C2_K05.2 ENC_K05.1), Designator/BANK_A/BTN_BOT (R8_BTN_BOT.1 SR_BTN_BOT.14)
NetC2_K06_2: Designator/BANK_A/K06 (C2_K06.2 ENC_K06.1), Designator/BANK_A/BTN_BOT (R8_BTN_BOT.2 SR_BTN_BOT.13)
NetC2_K07_2: Designator/BANK_A/K07 (C2_K07.2 ENC_K07.1), Designator/BANK_A/BTN_BOT (R8_BTN_BOT.3 SR_BTN_BOT.12)
NetC2_K08_2: Designator/BANK_A/K08 (C2_K08.2 ENC_K08.1), Designator/BANK_A/BTN_BOT (R8_BTN_BOT.4 SR_BTN_BOT.11)
NetC2_K09_2: Designator/BANK_A/K09 (C2_K09.2 ENC_K09.1), Designator/BANK_A/BTN_TOP (R8_BTN_TOP.4 SR_BTN_TOP.11)
NetC2_K10_2: Designator/BANK_A/K10 (C2_K10.2 ENC_K10.1), Designator/BANK_A/BTN_TOP (R8_BTN_TOP.3 SR_BTN_TOP.12)
NetC2_K11_2: Designator/BANK_A/K11 (C2_K11.2 ENC_K11.1), Designator/BANK_A/BTN_TOP (R8_BTN_TOP.2 SR_BTN_TOP.13)
NetC2_K12_2: Designator/BANK_A/K12 (C2_K12.2 ENC_K12.1), Designator/BANK_A/BTN_TOP (R8_BTN_TOP.1 SR_BTN_TOP.14)
NetC2_K13_2: Designator/BANK_A/K13 (C2_K13.2 ENC_K13.1), Designator/BANK_A/BTN_TOP (R7_BTN_TOP.1 SR_BTN_TOP.6)
NetC2_K14_2: Designator/BANK_A/K14 (C2_K14.2 ENC_K14.1), Designator/BANK_A/BTN_TOP (R7_BTN_TOP.2 SR_BTN_TOP.5)
NetC2_K15_2: Designator/BANK_A/K15 (C2_K15.2 ENC_K15.1), Designator/BANK_A/BTN_TOP (R7_BTN_TOP.3 SR_BTN_TOP.4)
NetC2_K16_2: Designator/BANK_A/K16 (C2_K16.2 ENC_K16.1), Designator/BANK_A/BTN_TOP (R7_BTN_TOP.4 SR_BTN_TOP.3)
NetC3_K01_2: Designator/BANK_A/K01 (C3_K01.2 ENC_K01.B), Designator/BANK_A/SX_BOT (R7_SX_BOT.4 SR_SX_BOT.3)
NetC3_K02_2: Designator/BANK_A/K02 (C3_K02.2 ENC_K02.B), Designator/BANK_A/SX_BOT (R7_SX_BOT.2 SR_SX_BOT.5)
NetC3_K03_2: Designator/BANK_A/K03 (C3_K03.2 ENC_K03.B), Designator/BANK_A/DX_BOT (R7_DX_BOT.4 SR_DX_BOT.3)
NetC3_K04_2: Designator/BANK_A/K04 (C3_K04.2 ENC_K04.B), Designator/BANK_A/DX_BOT (R7_DX_BOT.2 SR_DX_BOT.5)
NetC3_K05_2: Designator/BANK_A/K05 (C3_K05.2 ENC_K05.B), Designator/BANK_A/SX_BOT (R8_SX_BOT.2 SR_SX_BOT.13)
NetC3_K06_2: Designator/BANK_A/K06 (C3_K06.2 ENC_K06.B), Designator/BANK_A/SX_BOT (R8_SX_BOT.4 SR_SX_BOT.11)
NetC3_K07_2: Designator/BANK_A/K07 (C3_K07.2 ENC_K07.B), Designator/BANK_A/DX_BOT (R8_DX_BOT.2 SR_DX_BOT.13)
NetC3_K08_2: Designator/BANK_A/K08 (C3_K08.2 ENC_K08.B), Designator/BANK_A/DX_BOT (R8_DX_BOT.4 SR_DX_BOT.11)
NetC3_K09_2: Designator/BANK_A/K09 (C3_K09.2 ENC_K09.B), Designator/BANK_A/SX_TOP (R8_SX_TOP.4 SR_SX_TOP.11)
NetC3_K10_2: Designator/BANK_A/K10 (C3_K10.2 ENC_K10.B), Designator/BANK_A/SX_TOP (R8_SX_TOP.2 SR_SX_TOP.13)
NetC3_K11_2: Designator/BANK_A/K11 (C3_K11.2 ENC_K11.B), Designator/BANK_A/DX_TOP (R8_DX_TOP.4 SR_DX_TOP.11)
NetC3_K12_2: Designator/BANK_A/K12 (C3_K12.2 ENC_K12.B), Designator/BANK_A/DX_TOP (R8_DX_TOP.2 SR_DX_TOP.13)
NetC3_K13_2: Designator/BANK_A/K13 (C3_K13.2 ENC_K13.B), Designator/BANK_A/SX_TOP (R7_SX_TOP.2 SR_SX_TOP.5)
NetC3_K14_2: Designator/BANK_A/K14 (C3_K14.2 ENC_K14.B), Designator/BANK_A/SX_TOP (R7_SX_TOP.4 SR_SX_TOP.3)
NetC3_K15_2: Designator/BANK_A/K15 (C3_K15.2 ENC_K15.B), Designator/BANK_A/DX_TOP (R7_DX_TOP.2 SR_DX_TOP.5)
NetC3_K16_2: Designator/BANK_A/K16 (C3_K16.2 ENC_K16.B), Designator/BANK_A/DX_TOP (R7_DX_TOP.4 SR_DX_TOP.3)
NetC8_2: SURFACE (C8.2 SW1.1), Designator/BTN_FUNC (R7_BTN_FUNC.4 SR_BTN_FUNC.3)
NetC9_2: SURFACE (C9.2 SW2.1), Designator/BTN_FUNC (R8_BTN_FUNC.4 SR_BTN_FUNC.11)
NetC10_2: SURFACE (C10.2 SW3.1), Designator/BTN_FUNC (R7_BTN_FUNC.3 SR_BTN_FUNC.4)
NetC11_2: SURFACE (C11.2 SW4.1), Designator/BTN_FUNC (R8_BTN_FUNC.3 SR_BTN_FUNC.12)
NetC12_2: SURFACE (C12.2 SW5.1), Designator/BTN_FUNC (R8_BTN_FUNC.2 SR_BTN_FUNC.13)
NetC13_2: SURFACE (C13.2 SW6.1), Designator/BTN_FUNC (R7_BTN_FUNC.2 SR_BTN_FUNC.5)
NetLED_K01_2: Designator/BANK_A/K01 (LED_K01.2), Designator/BANK_A/K02 (LED_K02.5)
NetLED_K02_2: Designator/BANK_A/K02 (LED_K02.2), Designator/BANK_A/K03 (LED_K03.5)
NetLED_K03_2: Designator/BANK_A/K03 (LED_K03.2), Designator/BANK_A/K04 (LED_K04.5)
NetLED_K05_2: Designator/BANK_A/K05 (LED_K05.2), Designator/BANK_A/K06 (LED_K06.5)
NetLED_K06_2: Designator/BANK_A/K06 (LED_K06.2), Designator/BANK_A/K07 (LED_K07.5)
NetLED_K07_2: Designator/BANK_A/K07 (LED_K07.2), Designator/BANK_A/K08 (LED_K08.5)
NetLED_K09_2: Designator/BANK_A/K09 (LED_K09.2), Designator/BANK_A/K10 (LED_K10.5)
NetLED_K10_2: Designator/BANK_A/K10 (LED_K10.2), Designator/BANK_A/K11 (LED_K11.5)
NetLED_K11_2: Designator/BANK_A/K11 (LED_K11.2), Designator/BANK_A/K12 (LED_K12.5)
NetLED_K13_2: Designator/BANK_A/K13 (LED_K13.2), Designator/BANK_A/K14 (LED_K14.5)
NetLED_K14_2: Designator/BANK_A/K14 (LED_K14.2), Designator/BANK_A/K15 (LED_K15.5)
NetLED_K15_2: Designator/BANK_A/K15 (LED_K15.2), Designator/BANK_A/K16 (LED_K16.5)
NetSR_BTN_BOT_9: Designator/BANK_A/BTN_BOT (SR_BTN_BOT.9), Designator/BANK_A/SX_BOT (SR_SX_BOT.10)
NetSR_BTN_BOT_10: Designator/BANK_A/BTN_BOT (SR_BTN_BOT.10), Designator/BANK_A/DX_BOT (SR_DX_BOT.9)
NetSR_BTN_FUNC_9: Designator/BTN_FUNC (SR_BTN_FUNC.9), Designator/BANK_A/SX_TOP (SR_SX_TOP.10)
NetSR_BTN_FUNC_10: Designator/BTN_FUNC (SR_BTN_FUNC.10), Designator/BANK_A/SX_BOT (SR_SX_BOT.9)
NetSR_BTN_TOP_9: Designator/BANK_A/BTN_TOP (SR_BTN_TOP.9), Designator/BANK_A/DX_TOP (SR_DX_TOP.10)
NetSR_BTN_TOP_10: Designator/BANK_A/BTN_TOP (SR_BTN_TOP.10), Designator/BANK_A/SX_TOP (SR_SX_TOP.9)
nPL: SURFACE (R2.2), Designator/BTN_FUNC (SR_BTN_FUNC.1), Designator/BANK_A/BTN_TOP (SR_BTN_TOP.1), Designator/BANK_A/SX_TOP (SR_SX_TOP.1), Designator/BANK_A/DX_TOP (SR_DX_TOP.1), Designator/BANK_A/BTN_BOT (SR_BTN_BOT.1), Designator/BANK_A/SX_BOT (SR_SX_BOT.1), Designator/BANK_A/DX_BOT (SR_DX_BOT.1)

## Assembly variants
PROD: not fitted C8 C9 C10 C11 C12 C13